# EAGLE design power_supply (EAGLE 9.1.1)
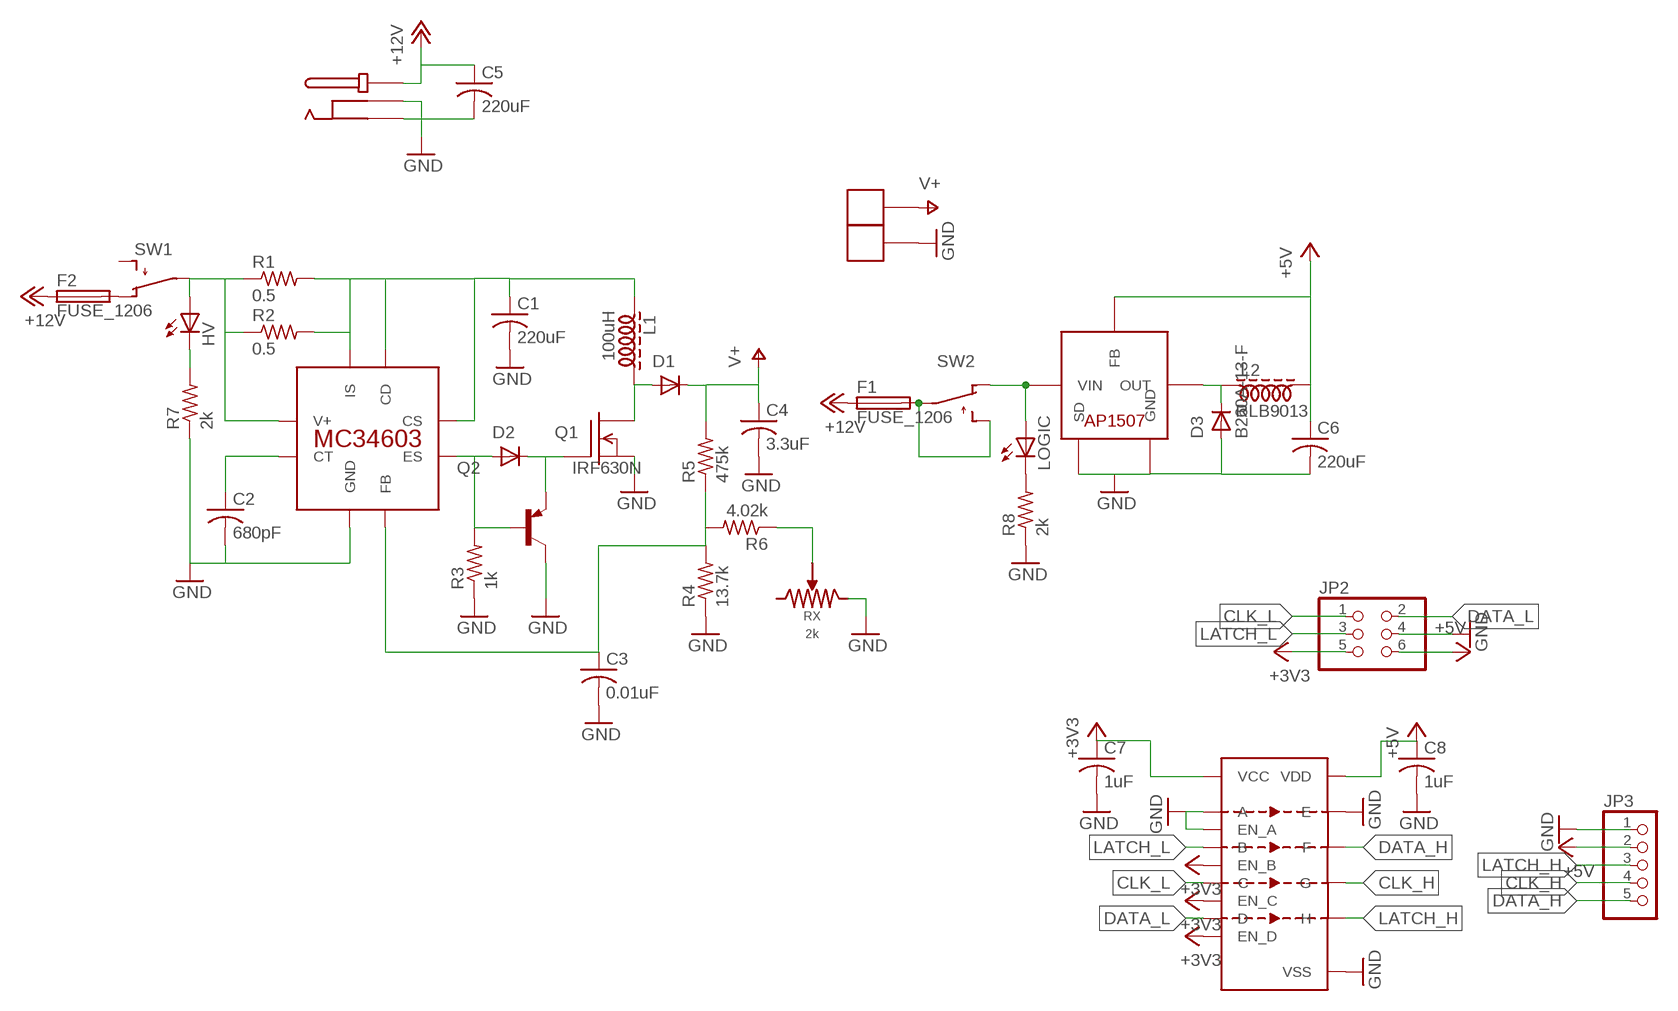
[diagram p0: schematic, sheet 1]

## Parts
C1  220uF  UUR1C221MCL6GS  [CAPAE830X1050]
C2  680pF  C0402  [C0402]
C3  0.01uF  C0402  [C0402]
C4  3.3uF  UUR1C221MCL6GS  [CAPAE830X1050]
C5  220uF  UUR1C221MCL6GS  [CAPAE830X1050]
C6  220uF  UUR1C221MCL6GS  [CAPAE830X1050]
C7  1uF  C0402  [C0402]
C8  1uF  C0402  [C0402]
D1  BAV21W  [SOD3616X115]
D2  MMBD914L  [SOT23]
D3  B260A-13-F  [DIOM4326X230]
F1  FUSE_1206  [R1206]
F2  FUSE_1206  [R1206]
HV  LEDCHIP-LED0805  [CHIP-LED0805]
JP2  PINHD-2X3  [2X03]
JP3  PINHD-1X5  [1X05]
L1  100uH  RLB9012  [RLB9012]
L2  RLB9013  [RLB9013]
LOGIC  LEDCHIP-LED0805  [CHIP-LED0805]
Q1  IRF630N  [TO254P1524X483-3]
Q2  BC807-16-PNP-SOT23-BEC  [SOT23-BEC]
R1  0.5  R-US_R1206  [R1206]
R2  0.5  R-US_R1206  [R1206]
R3  1k  R-US_R0805  [R0805]
R4  13.7k  R-US_R1206  [R1206]
R5  475k  R-US_R1206  [R1206]
R6  4.02k  R-US_R1206  [R1206]
R7  2k  R-US_R0805  [R0805]
R8  2k  R-US_R0805  [R0805]
RX  2k  TC33X-2  [TC33X-2]
SW1  T411001B  [T411001B]
SW2  T411001B  [T411001B]
U1  MC34063  [SOIC127P600X175-8]
U2  AP1507SOIC-8  [SOIC127P600X175-8]
U3  CD40109B_SPLITEN  [SOP65P640X120-16]
U$1  EJ508A  [EJ508A]
U$5  ZKFDS  [ZKFDS]
U$6  ZKFDS  [ZKFDS]

## Nets
+3V3: C7.1(+) JP2.5 U3.1(VCC) U3.7(EN_B) U3.9(EN_C) U3.15(EN_D)
+5V: C6.1(+) C8.1(+) JP2.6 JP3.2 L2.P$2 U2.3(FB) U3.16(VDD)
+12V: C5.1(+) F1.1 F2.1 U$1.P$1
CLK_H: JP3.4 U3.11(G)
CLK_L: JP2.1 U3.10(C)
DATA_H: JP3.5 U3.5(F)
DATA_L: JP2.2 U3.14(D)
GND: C1.2(-) C2.2(-) C3.2(-) C4.2(-) C5.2(-) C6.2(-) C7.2(-) C8.2(-) D3.2(A) JP2.4 JP3.1 Q1.2(S) Q2.C R3.1 R4.1 R7.1 R8.1 RX.P$3 U1.4(GND) U2.4(SD) U2.5(GND) U2.6(GND) U2.7(GND) U2.8(GND) U3.2(EN_A) U3.3(A) U3.4(E) U3.8(VSS) U3.12(VSS) U$1.P$2 U$1.P$3 U$6.P$1 U$6.P$2
LATCH_H: JP3.3 U3.13(H)
LATCH_L: JP2.3 U3.6(B)
N$1: C1.1(+) L1.P$1 R1.2 R2.2 U1.1(CS) U1.7(IS) U1.8(CD)
N$2: D1.1(A) L1.P$2 Q1.3(D)
N$3: R6.1 RX.P$2
N$4: D2.1(A) Q2.B R3.2 U1.2(ES)
N$5: D2.3(C) Q1.1(G) Q2.E
N$6: HV.A R1.1 R2.1 SW1.P$2 U1.6(V+)
N$7: C2.1(+) U1.3(CT)
N$8: LOGIC.A SW2.P$1 U2.1(VIN)
N$9: C3.1(+) R4.2 R5.1 R6.2 U1.5(FB)
N$10: D3.1(C) L2.P$1 U2.2(OUT)
N$11: HV.C R7.2
N$12: LOGIC.C R8.2
N$13: F1.2 SW2.P$2 SW2.P$3
N$14: F2.2 SW1.P$1
V+: C4.1(+) D1.2(C) R5.2 U$5.P$1 U$5.P$2
Unconnected: RX.P$1 SW1.P$3

## Library data of the parts
C1 C4-C6 = nixie_ticker:UUR1C221MCL6GS
C2 C3 C7 C8 = nixie_ticker:C0402
D1 = nixie_ticker:BAV21W
D2 = nixie_ticker:MMBD914L
D3 = nixie_ticker:B260A-13-F
F1 F2 = nixie_ticker:FUSE_1206
HV LOGIC = led:LED: LED OSRAM: - CHIPLED LG R971, LG N971, LY N971, LG Q971, LY Q971, LO R971, LY R971 LH N974, LH R974 LS Q976, LO Q976, LY Q976 LO Q996 - Hyper CHIPLED LW Q18S LB Q993, LB Q99A, LB R99A - SideLED LS A670, LO A670, LY A670, LG A670, LP A670 LB A673, LV A673, LT A673, LW A673 LH A674 LY A675 LS A676, LA A676, LO A676, LY A676, LW A676 LS A679, LY A679, LG A679 - Hyper Micro SIDELED® LS Y876, LA Y876, LO Y876, LY Y876 LT Y87S - SmartLED LW L88C, LW L88S LB L89C, LB L89S, LG L890 LS L89K, LO L89K, LY L89K LS L896, LA L896, LO L896, LY L896 - TOPLED LS T670, LO T670, LY T670, LG T670, LP T670 LSG T670, LSP T670, LSY T670, LOP T670, LYG T670 LG T671, LOG T671, LSG T671 LB T673, LV T673, LT T673, LW T673 LH T674 LS T676, LA T676, LO T676, LY T676, LB T676, LH T676, LSB T676, LW T676 LB T67C, LV T67C, LT T67C, LS T67K, LO T67K, LY T67K, LW E67C LS E67B, LA E67B, LO E67B, LY E67B, LB E67C, LV E67C, LT E67C LW T67C LS T679, LY T679, LG T679 LS T770, LO T770, LY T770, LG T770, LP T770 LB T773, LV T773, LT T773, LW T773 LH T774 LS E675, LA E675, LY E675, LS T675 LS T776, LA T776, LO T776, LY T776, LB T776 LHGB T686 LT T68C, LB T68C - Hyper Mini TOPLED® LB M676 - Mini TOPLED Santana® LG M470 LS M47K, LO M47K, LY M47K Source: http://www.osram.convergy.de LUXEON: - LUMILED® LXK2-PW12-R00, LXK2-PW12-S00, LXK2-PW14-U00, LXK2-PW14-V00 LXK2-PM12-R00, LXK2-PM12-S00, LXK2-PM14-U00 LXK2-PE12-Q00, LXK2-PE12-R00, LXK2-PE12-S00, LXK2-PE14-T00, LXK2-PE14-U00 LXK2-PB12-K00, LXK2-PB12-L00, LXK2-PB12-M00, LXK2-PB14-N00, LXK2-PB14-P00, LXK2-PB14-Q00 LXK2-PR12-L00, LXK2-PR12-M00, LXK2-PR14-Q00, LXK2-PR14-R00 LXK2-PD12-Q00, LXK2-PD12-R00, LXK2-PD12-S00 LXK2-PH12-R00, LXK2-PH12-S00 LXK2-PL12-P00, LXK2-PL12-Q00, LXK2-PL12-R00 Source: www.luxeon.com KINGBRIGHT: KA-3528ASYC Source: www.kingbright.com
JP2 = pinhead:PINHD-2X3: PIN HEADER
JP3 = pinhead:PINHD-1X5: PIN HEADER
L1 = nixie_ticker:RLB9012
L2 = nixie_ticker:RLB9013
Q1 = nixie_ticker:IRF630N
Q2 = transistor:*-PNP-: PNP Transistror
R1-R8 = resistor:R-US_: RESISTOR, American symbol
RX = nixie_ticker:TC33X-2
SW1 SW2 = nixie_ticker:T411001B
U1 = nixie_ticker:MC34063
U2 = nixie_ticker:AP1507
U3 = nixie_ticker:CD40109B_SPLITEN
U$1 = nixie_ticker:EJ508A
U$5 U$6 = nixie_ticker:ZKFDS

## Board
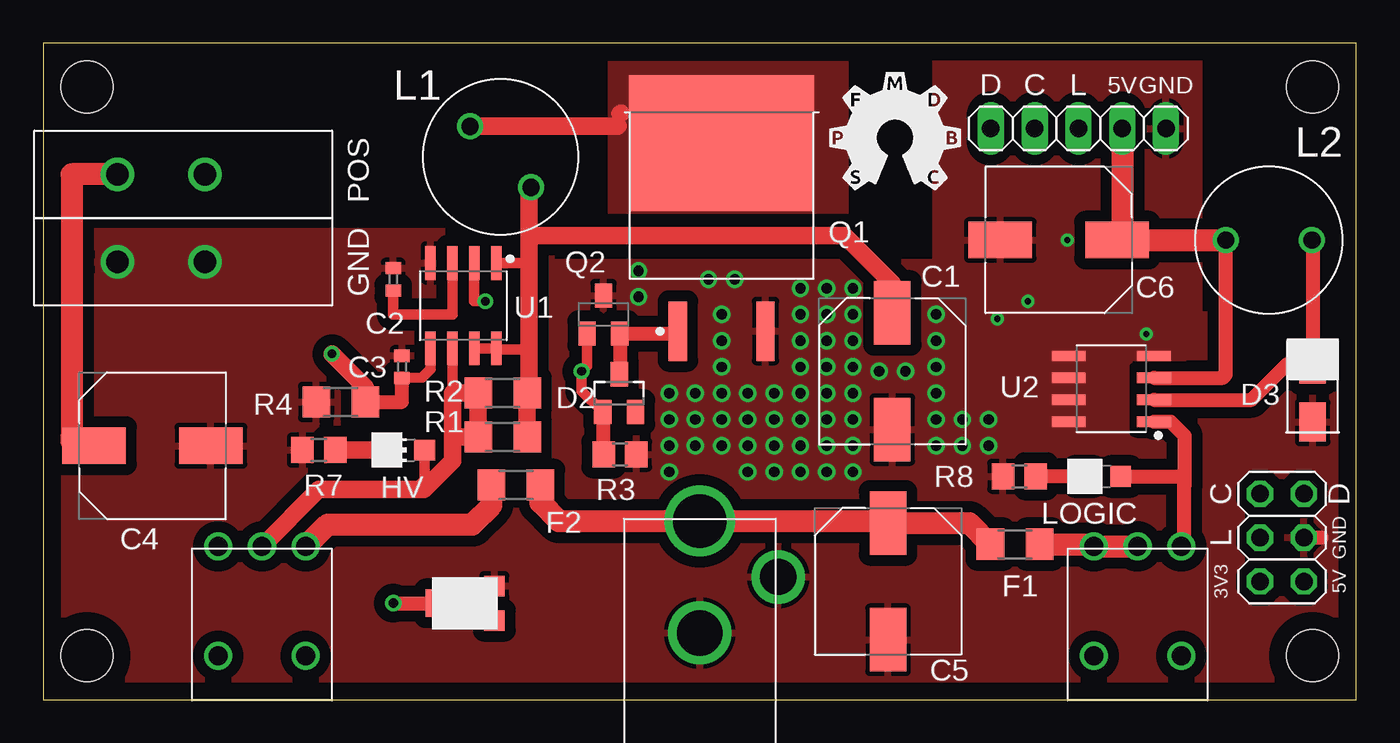
[diagram p1: board, top side]
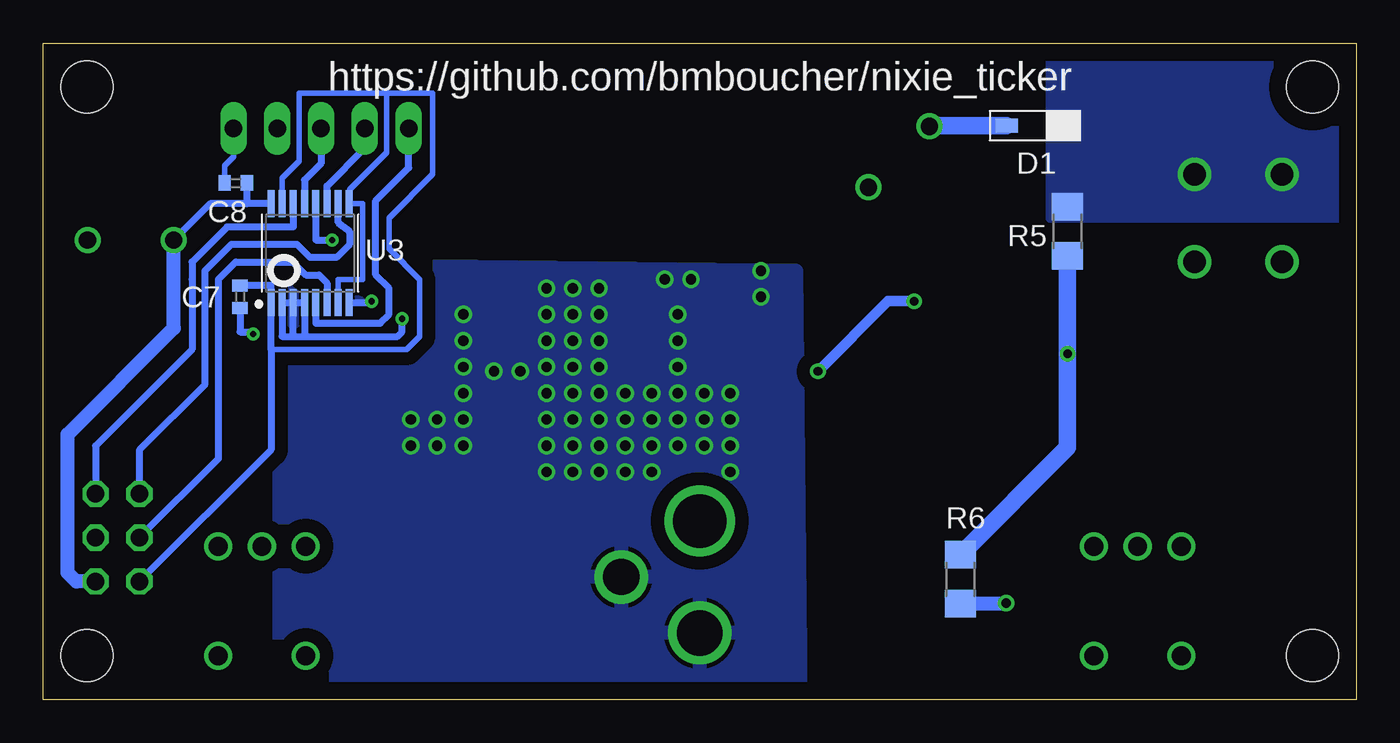
[diagram p2: board, bottom side, seen from below]

Size 76.2 x 38.1 mm. Coordinates in mm from the lower left corner, seen from the top.
Outline: 0,0 76.2,0 76.2,38.1 0,38.1 0,0
Copper layers (1*16): Top 0.035mm / dielectric 1.5mm / Bottom 0.035mm
Design rules "default *": minimum track width 6mil, minimum drill 0.35mm, track to track 6mil, track to pad 6mil, pad to pad 6mil, via to via 6mil, smd to smd 6mil, copper to edge 40mil, drill to drill 6mil, minimum pad ring 10mil, minimum via ring 8mil, stop-mask expansion 4mil, vias tented up to drill 30mil, thermal gap 10mil
Holes 3 mm at 2.54,2.54 73.66,2.54 2.54,35.56 73.66,35.56

### Footprints (pad centres in the part's own frame; a part is rotated, then mirrored left to right if it is on the bottom)
CAPAE830X1050 = smd 3.687 x 2.12: 1 -3.388,0; 2 3.388,0
C0402 = smd 0.7 x 0.9: 1 -0.65,0; 2 0.65,0
SOD3616X115 = smd 1.31 x 0.789: 1 -1.65,0; 2 1.65,0
SOT23 = smd 1 x 1.4: 1 -0.95,-1.1; 2 0.95,-1.1; 3 0,1.1
DIOM4326X230 = smd 2.255 x 1.547: 1 -1.677,0; 2 1.677,0
R1206 = smd 1.6 x 1.803: 1 -1.422,0; 2 1.422,0
CHIP-LED0805 = smd 1.2 x 1.2: A 0,-1.05; C 0,1.05
2X03 = drill 1.016 octagon: 1 -2.54,-1.27; 2 -2.54,1.27; 3 0,-1.27; 4 0,1.27; 5 2.54,-1.27; 6 2.54,1.27
1X05 = drill 1.016 long: 1 -5.08,0; 2 -2.54,0; 3 0,0; 4 2.54,0; 5 5.08,0
RLB9012 = drill 1: P$1 0,2.5; P$2 0,-2.5
RLB9013 = drill 1: P$1 0,2.5; P$2 0,-2.5
TO254P1524X483-3 = smd 3.464 x 1.063: 1 -6.56,2.54; 2 -6.56,-2.54 | smd 7.88 x 10.736: 3 4.353,0
SOT23-BEC = smd 1 x 1.4: B -0.95,-1.1; C 0,1.1; E 0.95,-1.1
R0805 = smd 1.3 x 1.5: 1 -0.95,0; 2 0.95,0
TC33X-2 = smd 1.2 x 1.2: P$1 -1,-1.8; P$3 1,-1.8 | smd 1.6 x 1.5: P$2 0,1.45
T411001B = drill 1.09: P$1 -2.54,-2.54; P$2 0,-2.54; P$3 2.54,-2.54; P$4 -2.54,3.81; P$5 2.54,3.81
SOIC127P600X175-8 = smd 1.968 x 0.602: 1 -2.473,1.905; 2 -2.473,0.635; 3 -2.473,-0.635; 4 -2.473,-1.905; 5 2.473,-1.905; 6 2.473,-0.635; 7 2.473,0.635; 8 2.473,1.905
SOP65P640X120-16 = smd 1.572 x 0.407: 1 -2.872,2.275; 2 -2.872,1.625; 3 -2.872,0.975; 4 -2.872,0.325; 5 -2.872,-0.325; 6 -2.872,-0.975; 7 -2.872,-1.625; 8 -2.872,-2.275; 9 2.872,-2.275; 10 2.872,-1.625; 11 2.872,-0.975; 12 2.872,-0.325; 13 2.872,0.325; 14 2.872,0.975; 15 2.872,1.625; 16 2.872,2.275
EJ508A = drill 3.1: P$1 0,3.25 | drill 2.64: P$2 0,-3.25 | drill 2.1: P$3 4.55,0
ZKFDS = drill 1.3: P$1 0,5.08; P$2 0,0

### Placement (x,y rotation side)
C1  49.28,19.05 270 top
C2  20.32,24.38 90 top
C3  20.83,19.3 90 top
C4  6.35,14.73 0 top
C5  49.02,6.86 270 top
C6  58.93,26.67 180 top
C7  64.77,23.37 270 bottom
C8  65.02,29.97 180 bottom
D1  18.65,33.3 0 bottom
D2  33.43,17.78 0 top
D3  73.66,17.78 270 top
F1  56.39,9.02 0 top
F2  27.43,12.45 180 top
HV  21.08,14.48 90 top
JP2  71.88,9.4 270 top
JP3  60.07,33.15 180 top
L1  26.54,31.5 225 top
L2  71.12,26.67 270 top
LOGIC  61.47,12.95 90 top
Q1  39.37,27.94 90 top
Q2  32.51,22.35 0 top
R1  26.67,15.24 0 top
R2  26.67,17.78 0 top
R3  33.48,14.22 180 top
R4  17.27,17.27 0 top
R5  16.76,27.18 90 bottom
R6  22.99,6.99 90 bottom
R7  16,14.48 0 top
R8  56.64,12.95 0 top
RX  24.38,5.59 90 top
SW1  12.7,6.35 180 top
SW2  63.5,6.35 180 top
U1  24.38,22.86 270 top
U2  61.98,18.03 180 top
U3  60.71,25.91 90 bottom
U$1  38.1,7.11 0 top
U$5  4.32,30.48 270 top
U$6  4.32,25.4 270 top

### Tracks (layer width: path | path; a pad name or v marks a point on that pad's centre or on a via)
+3V3
  Bottom 0.305: 62.98,20.32 55.12,20.32 54.36,21.08 54.36,24.38 56.13,26.16 56.13,27.94 53.59,30.48 53.59,35.18 56.26,35.18 | 62.36,28.78 U3.15 62.33,30.25 61.34,31.24 61.34,35.18 56.26,35.18 | U3.7 59.08,24.38 57.66,24.38 57.66,28.78 U3.9 | U3.9 | U3.9 58.42,29.59 56.26,31.75 56.26,35.18
  Bottom 0.406: JP2.5 62.98,14.49 62.98,20.32 U3.1 62.98,24.02 C7.1
+5V
  Top 0.813: L2.P$2 68.62,18.84 68.45,18.67 U2.3
  Top 1.27: L2.P$2 C6.1 62.61,26.96 JP3.2
  Bottom 0.406: 62.98,28.92 U3.16 64.37,28.78 | 64.37,28.78 C8.1 | 64.37,28.78 66.51,28.78 L2.P$2
  Bottom 0.813: JP2.6 74.27,6.86 74.78,7.37 74.78,15.39 68.62,21.55 L2.P$2
+12V
  Top 1.27: F1.1 53.74,10.25 C5.1 48.91,10.36 U$1.P$1 29.92,10.36 28.85,11.43 F2.1
CLK_H
  Bottom 0.406: JP3.4 57.53,32 59.73,29.8 U3.11
CLK_L
  Bottom 0.406: JP2.1 70.61,14.48 66.8,18.29 66.8,24.89 65.28,26.42 61.47,26.42 60.71,25.65 59.18,25.65 58.42,26.42 58.42,27.18 59.08,27.69 U3.10
DATA_H
  Bottom 0.406: U3.5 60.38,21.84 56.64,21.84 56.13,22.35 56.13,23.88 56.9,24.64 56.9,28.96 54.99,30.86 JP3.5
DATA_L
  Bottom 0.406: JP2.2 73.15,14.73 67.56,20.32 67.56,24.38 67.56,25.4 65.53,27.43 61.68,27.43 U3.14
GND  (via drill 0.35, 0.6)
  Top 0.813: JP2.4 74.17,9.4
  Bottom 0.305: C8.2 65.67,30.97 65.15,31.5 JP3.1
  Bottom 0.406: U3.3 U3.2 62.33,21.08 61.72,21.08 | U3.3 U3.4 61.03,21.08 | U3.8 57.15,23.04 v57.15,23.11 | U3.12 60.38,26.67 v59.44,26.67 | 61.72,21.08 61.03,21.08 | 61.03,21.08 55.63,21.08 55.37,21.34 v55.37,22.1 | U3.3 61.72,23.04 61.72,21.08 | C7.2 64.77,21.34 64.14,21.34 v64.01,21.21
  other vias: 43.94,13.21 36.32,16.26 36.32,14.73 37.85,17.78 37.85,16.26 37.85,14.73 39.37,14.73 39.37,16.26 39.37,17.78 40.89,17.78 40.89,16.26 40.89,14.73 42.42,14.73 42.42,16.26 42.42,17.78 43.94,17.78 43.94,16.26 43.94,14.73 42.42,13.21 40.89,13.21 36.32,13.21 39.37,19.3 43.94,19.3 45.47,19.3 45.47,17.78 45.47,16.26 34.54,23.37 34.54,24.89 38.61,24.38 40.13,24.38 43.94,23.88 45.47,23.88 36.32,17.78 45.47,14.73 45.47,13.21 43.94,22.35 45.47,22.35 45.47,20.83 43.94,20.83 39.37,20.83 39.37,22.35 46.99,22.35 46.99,23.88 46.99,20.83 46.99,19.3 46.99,17.78 46.99,16.26 46.99,14.73 46.99,13.21 48.51,19.05 50.04,19.05 51.82,22.35 51.82,20.83 51.82,19.3 51.82,17.78 51.82,16.26 51.82,14.73 53.34,16.26 53.34,14.73 54.86,14.73 54.86,16.26
  pour Top (isolate 0.635, rank 4): 0,27.18 29.46,27.18 29.46,25.4 51.82,25.4 51.82,37.85 67.06,37.85 67.06,22.35 76.2,22.35 76.2,0 0,0
  pour Bottom (isolate 0.762): 32.26,0 62.48,0.38 62.48,25.27 32.51,24.89
  pour Top (no thermals): 55.88,21.34 66.29,21.34 66.29,19.68 62.99,19.68 62.99,14.73 55.88,14.73
  pour Top (no thermals): 3.05,27.18 10.92,27.18 10.92,23.11 3.05,23.11
LATCH_H
  Bottom 0.406: JP3.3 60.07,31.11 61.03,30.16 U3.13
LATCH_L
  Bottom 0.406: JP2.3 66.04,13.97 66.04,24.38 65.02,25.4 61.72,25.4 60.96,24.64 60.2,24.64 59.73,24.17 U3.6
N$1
  Top 0.305: R2.2 28.09,17.63 28.19,17.53
  Top 0.61: U1.8 26.29,20.45 26.23,20.39 | U1.7 U1.8 | U1.8 26.36,20.32 28.19,20.32 | U1.1 28.01,25.33 28.19,25.15
  Top 1.016: R1.2 R2.2 | C1.1 49.28,24.13 46.48,26.92 28.33,26.92 28.19,26.79 | 28.19,17.53 28.19,20.32 28.19,25.15 28.19,26.79 | 28.19,26.79 28.19,29.61 L1.P$1
N$2
  Top 1.016: 33.49,34 33.53,34.04 | L1.P$2 33.33,33.26 33.36,33.3
  Bottom 1.016: D1.1 24.73,33.3 L1.P$2
  pour Top (no thermals): 46.74,37.34 46.74,28.19 32.77,28.19 32.77,37.34
  cutout Top: 30.48,32.77 26.92,32.77 26.92,36.83 18.8,36.83 18.8,27.43 23.37,27.43 23.37,26.42 29.46,26.42 30.48,27.43
N$3  (via drill 0.55)
  Top 0.813: v20.32,5.59 RX.P$2
  Bottom 0.813: v20.32,5.59 22.96,5.59 R6.1
N$4  (via drill 0.5)
  Top 0.61: v25.65,23.11 25.02,23.11 U1.2 | Q2.B 31.56,19.37 v31.24,19.05 31.24,17.91 D2.1
  Top 0.813: 32.51,16.64 D2.1 32.48,14.28 R3.2
  Bottom 0.61: v31.24,19.05 27.18,23.11 v25.65,23.11
N$5
  Top 0.61: 36.83,20.57 Q1.1 | 33.46,18.88 D2.3
  Top 0.813: 36.7,21.25 Q2.E 33.46,18.88
  Top 1.016: 36.7,21.25 Q1.1
N$6
  Top 0.61: 23.75,17.78 U1.6 | HV.A 22.13,12.73 21.59,12.19
  Top 1.016: SW1.P$2 16,12.19 21.59,12.19 22.1,12.19 23.75,13.84 23.75,15.24 | 23.75,15.24 23.75,17.78 R2.1 R1.1 23.75,15.24
N$7
  Top 0.61: U1.3 23.75,22.35 20.32,22.35 C2.1
N$8
  Top 0.813: 66.22,9.07 66.22,12.45 | 66.22,12.45 66.22,12.95 LOGIC.A | U2.1 65.41,16.13 66.22,15.32 66.22,12.45
  Top 1.016: SW2.P$1 66.22,9.07
N$9  (via drill 0.5)
  Top 0.61: U1.5 22.48,19.18 21.99,18.68 C3.1
  Top 0.813: R4.2 20.83,17.27 C3.1
  Top 1.016: R4.2 18.69,18.14 v16.76,20.07
  Bottom 1.016: R5.1 v16.76,20.07 16.76,14.63 R6.2
N$10
  Top 0.813: L2.P$1 73.66,26.12 D3.1 72.16,19.46 70.1,17.4 U2.2
N$11
  Top 1.016: R7.2 HV.C
N$12
  Top 0.813: LOGIC.C R8.2
N$13
  Top 1.27: F1.2 60.83,9.02 SW2.P$3 SW2.P$2
N$14
  Top 1.27: SW1.P$1 16.51,10.16 24.89,10.16 26.01,11.28 F2.2
V+
  Top 1.27: U$5.P$2 1.65,30.48 1.65,15.24 | 1.65,14.99 1.65,15.24 | 1.65,15.24 C4.1
  pour Bottom (isolate 0.508, no thermals): 17.78,38.1 17.78,27.94 0,27.94 0,38.1

### Text on the board
tPlace: D | C | L | 5V | GND | L1 | POS | L2 | GND | C | D | L | GND | 3V3 | 5V
bPlace: https://github.com/bmboucher/nixie_ticker